# EAGLE design Environment-ArduinoNano33-V10-CustomBottoms-Steve (EAGLE 7.4.0)
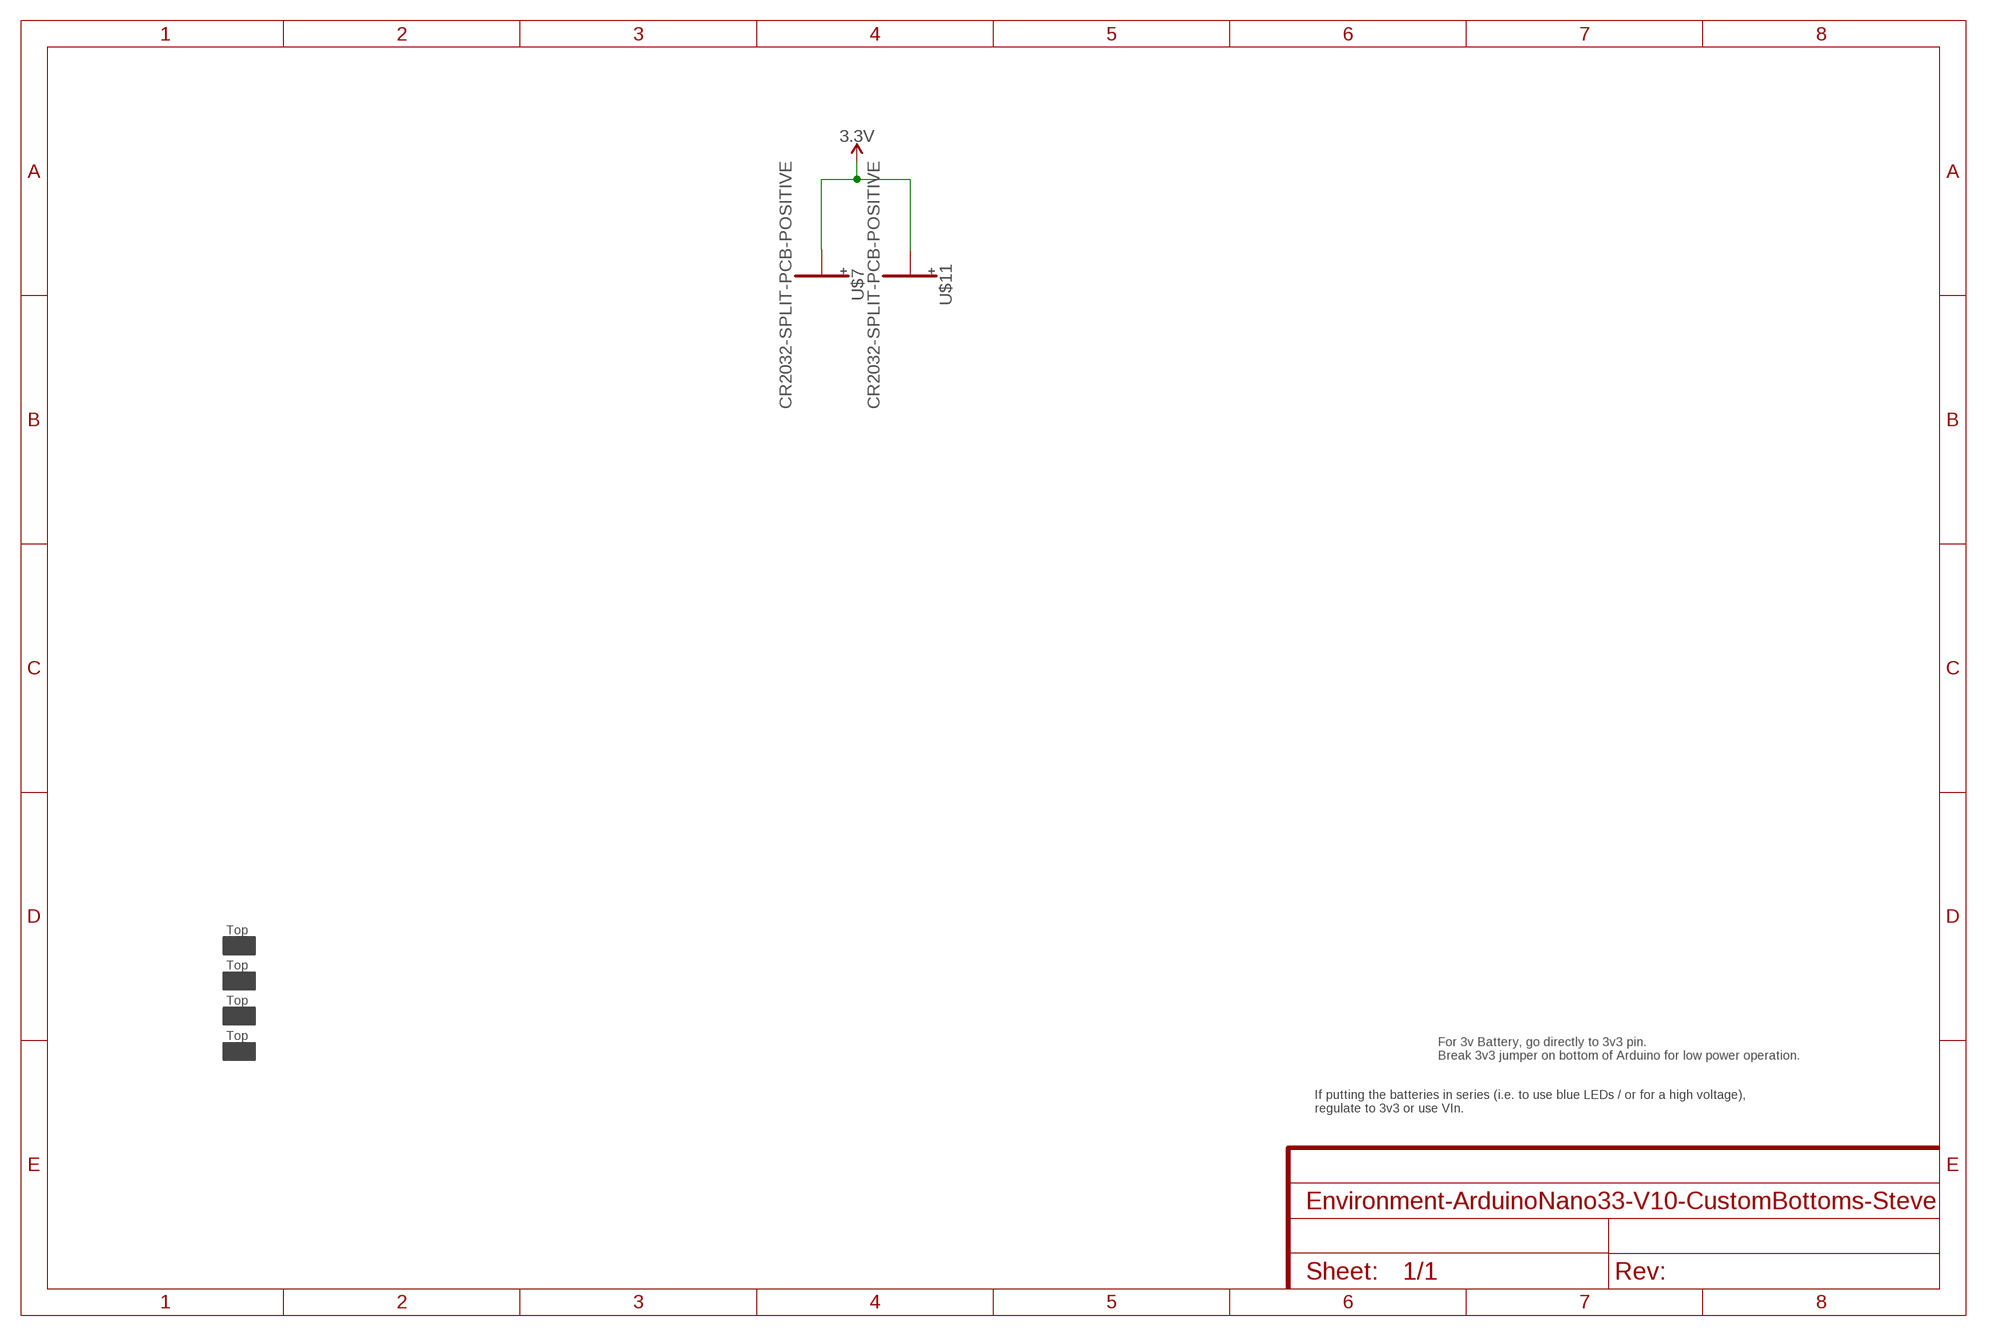
[diagram p0: schematic, sheet 1]

## Parts
U$1  PERSONAL_ENVIRONMENT_SENSORTOP  [PERSONAL_ENVIRONMENT_SENSOR_TOP]
U$2  PERSONAL_ENVIRONMENT_SENSORMIDDLE  [PERSONAL_ENVIRONMENT_SENSOR_MIDDLE_KEYRING]
U$3  PERSONAL_ENVIRONMENT_SENSORBOTTOM  [PERSONAL_ENVIRONMENT_SENSOR_BOTTOM]
U$4  PERSONAL_ENVIRONMENT_SENSORBOTTOM_TEMPLATE  [PERSONAL_ENVIRONMENT_SENSOR_BOTTOM_TEMPLATE]
U$7  CR2032-SPLIT-PCB-POSITIVE  [CR2032-SMD-POSITIVE-TERMINAL]
U$11  CR2032-SPLIT-PCB-POSITIVE  [CR2032-SMD-POSITIVE-TERMINAL]

## Nets
3.3V: U$7.+ U$11.+

## Notes on the sheet
- For 3v Battery, go directly to 3v3 pin.
  Break 3v3 jumper on bottom of Arduino for low power operation.
- If putting the batteries in series (i.e. to use blue LEDs / or for a high voltage), 
  regulate to 3v3 or use VIn.

## Library data of the parts
U$1-U$4 = ThingySticks:PERSONAL_ENVIRONMENT_SENSOR
U$7 U$11 = ThingySticks:CR2032-SPLIT-PCB-POSITIVE

## Board
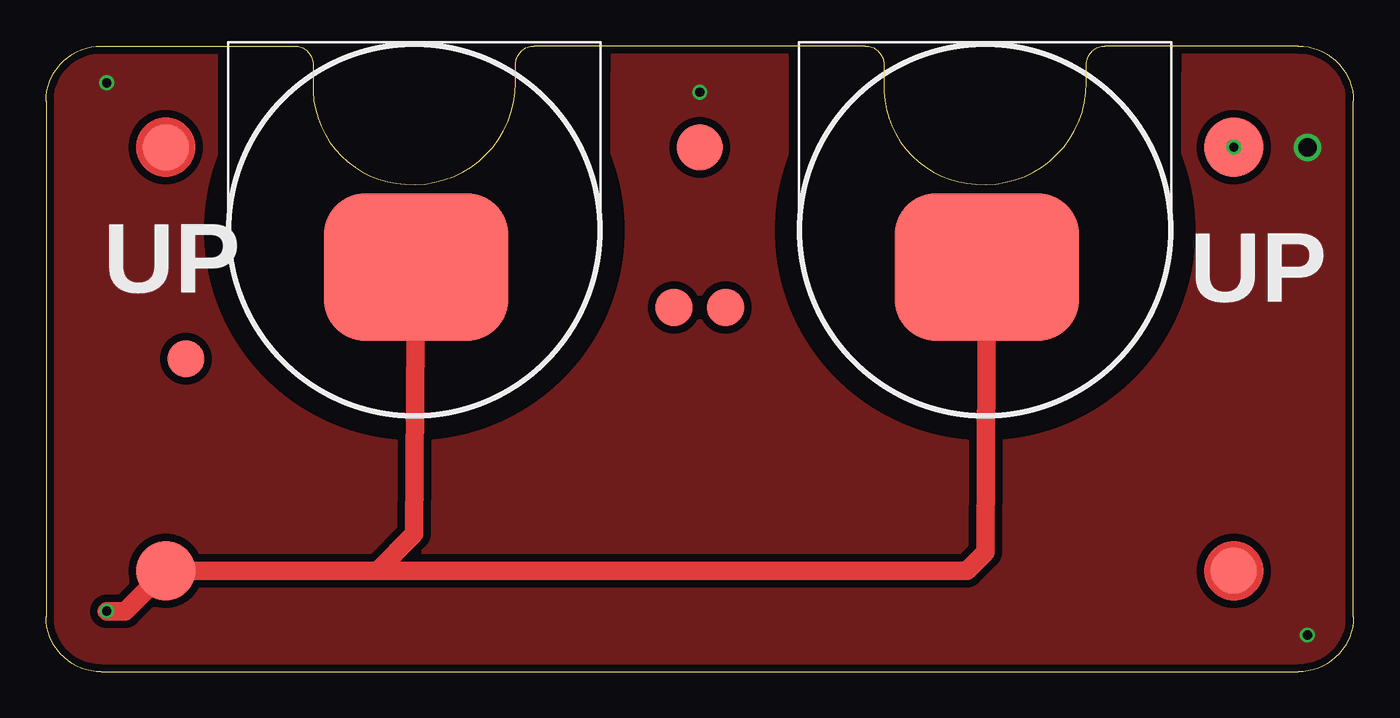
[diagram p1: board, top side]
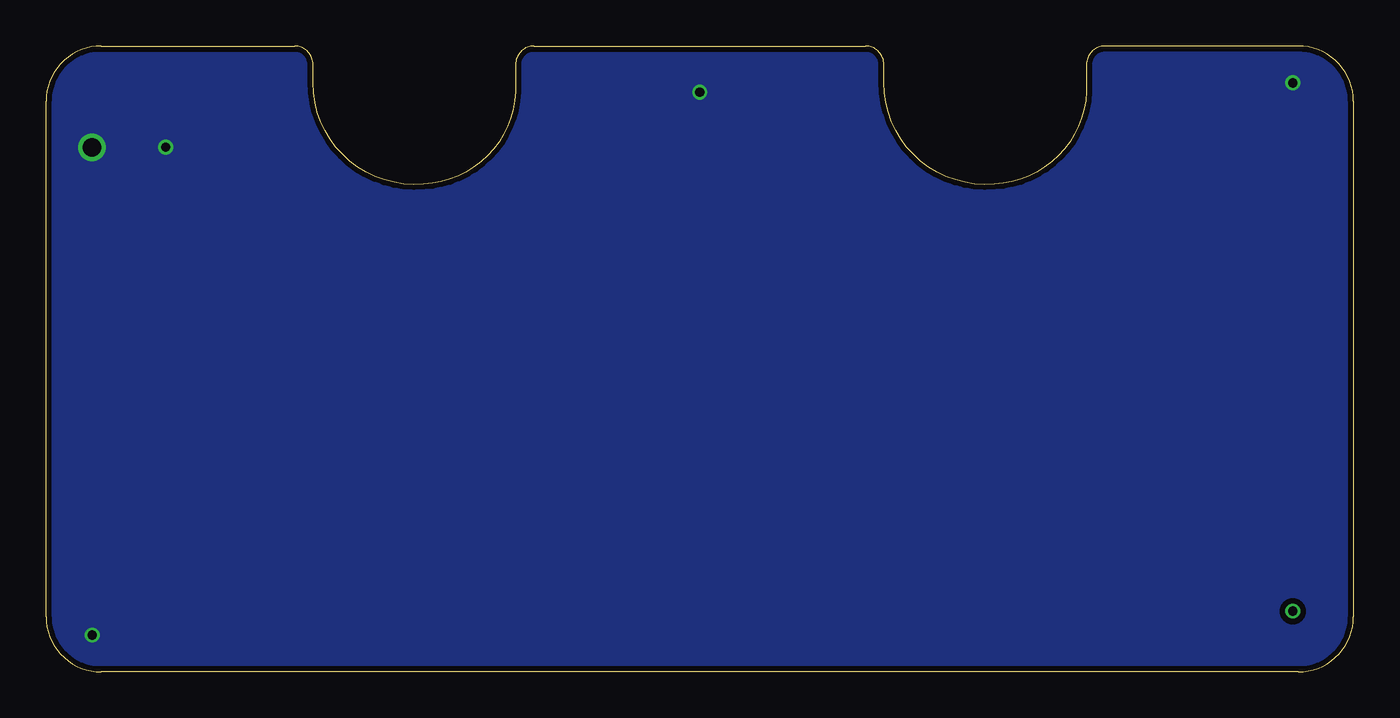
[diagram p2: board, bottom side, seen from below]

Size 71 x 34 mm. Coordinates in mm from the lower left corner, seen from the top.
Copper layers (1*16): Top 0.035mm / dielectric 1.5mm / Bottom 0.035mm
Design rules "dirt_cheap_dirty_boards.v1.1": minimum track width 6mil, minimum drill 12mil, track to track 6mil, track to pad 6mil, pad to pad 6mil, via to via 6mil, smd to smd 0mil, copper to edge 10mil, drill to drill 10mil, minimum pad ring 10mil, minimum via ring 6mil, stop-mask expansion 2mil, vias tented up to drill 25mil, thermal gap 10mil

### Footprints (pad centres in the part's own frame; a part is rotated, then mirrored left to right if it is on the bottom)
PERSONAL_ENVIRONMENT_SENSOR_BOTTOM_TEMPLATE = smd 3.2 x 3.2: 3V3 6.5,5.5; GND 64.5,28.5 | smd 2 x 2: NFC1 34.1,19.8; NFC2 36.9,19.8; P$2 7.6,17 | smd 2.5 x 2.5: P$1 35.5,28.5; P$5 6.5,28.5; P$6 64.5,5.5
CR2032-SMD-POSITIVE-TERMINAL = smd 10 x 8 bottom: + -0.1,-2

### Placement (x,y rotation side)
U$1  -0.5,79.5 0 top  (outside the outline)
U$2  -0.5,43.5 0 top  (outside the outline)
U$3  -0.5,117 0 top  (outside the outline)
U$4  0,0 0 top
U$7  20,24 0 bottom
U$11  51,24 0 bottom

### Tracks (layer width: path | path; a pad name or v marks a point on that pad's centre or on a via)
3.3V  (via drill 0.5)
  Top 1.016: U$7.+ 20,7.5 18,5.5 | 18,5.5 6.5,5.5 4.3,3.3 v3.3,3.3 | U$11.+ 51,6.5 50,5.5 18,5.5
GND  (via drill 0.5, 1)
  other vias: 35.5,31.5 68.5,28.5 3.3,32 68.5,2 64.5,28.5
  pour Bottom (isolate 0.305, rank 4): 0,34 71,34 71,0 0,0
  pour Top (isolate 0.406): 0,34 71.5,34 71.5,0 0,0
(copper drawn outside any net)
  shapes: Top circle x4

### Text on the board
tValues: ThingySticks / Custom Name Base
bStop: + | + | Steve | ThingySticks
Document: Top PCB has pads on solder side / for battery -VE connection
Reference: Bottom PCB
tDocu: NFC Pads